# Altium schematic sheet AC Zero-Crossing Detection.SchDoc
size Letter
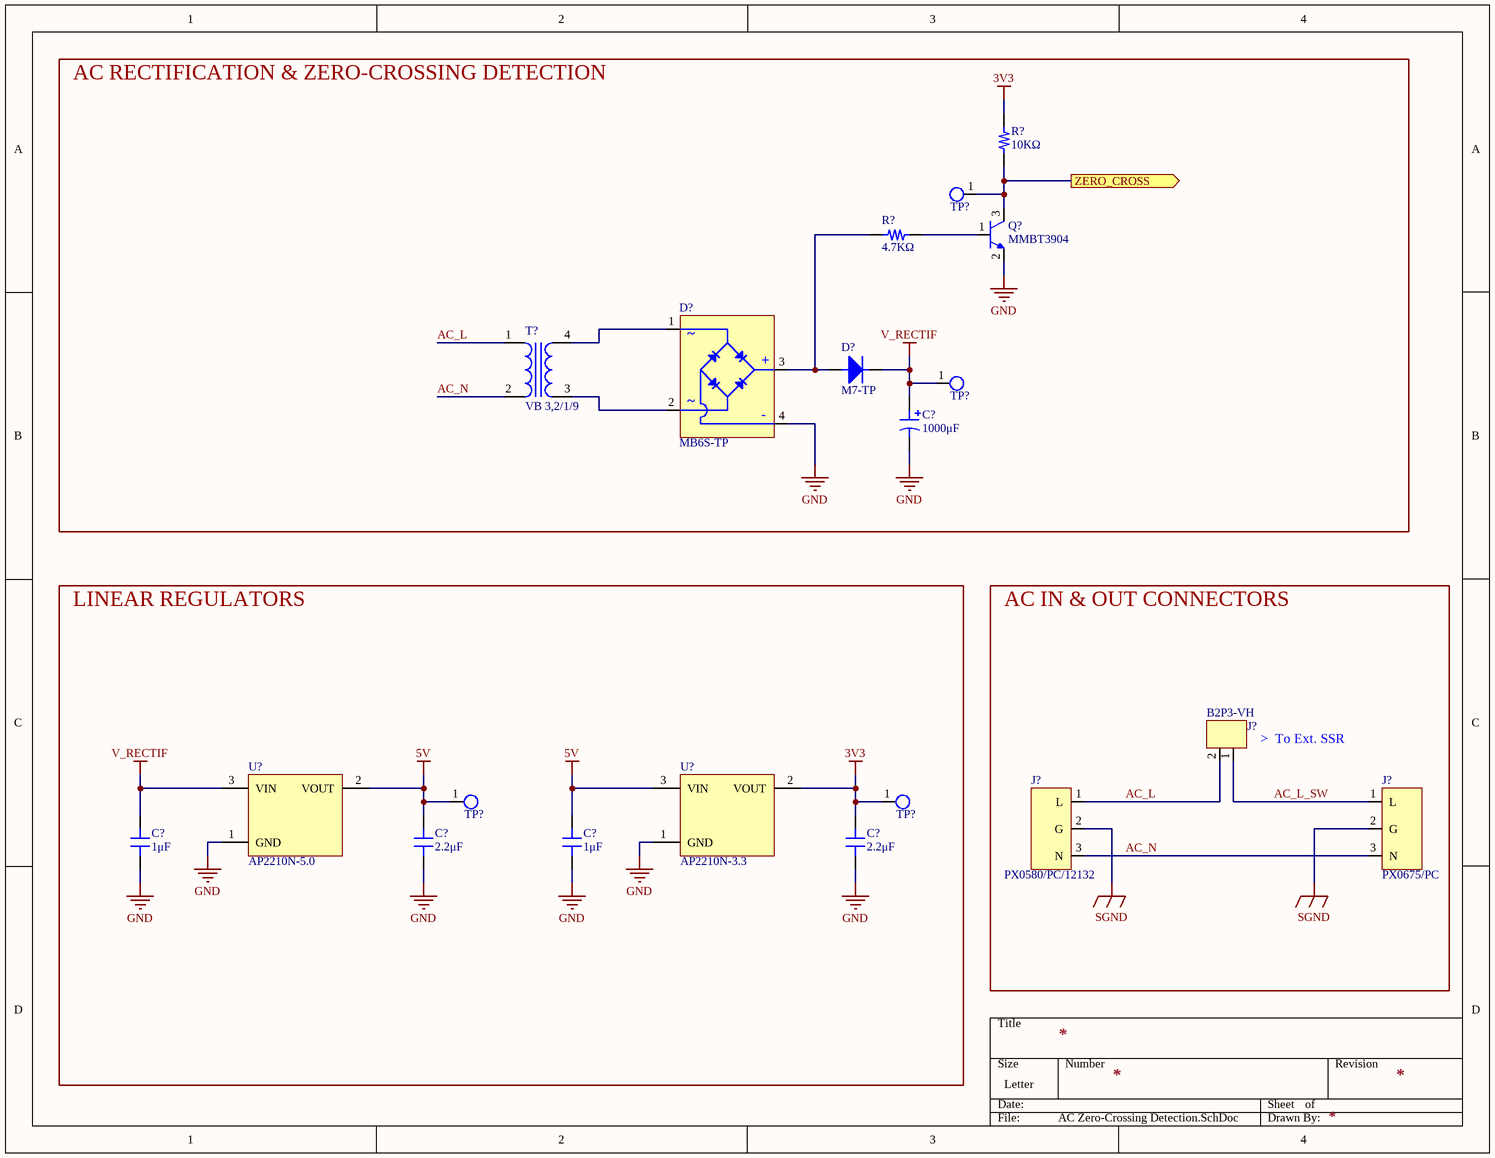
[diagram p0: AC Zero-Crossing Detection.SchDoc]

## Parts
(Parts that share a designator on the sheet are numbered #1, #2 ... from top to bottom, then left to right.)
C?#1  1000μF  [CPOL10X20]
C?#2  1μF  [C0603]
C?#3  2.2μF  [C0805]
C?#4  1μF  [C0603]
C?#5  2.2μF  [C0805]
D?#1  M7-TP  [DO-214AC]
D?#2  MB6S-TP  [MBS-1]
J?#1  B2P3-VH  [B2P3-VH]
J?#2  PX0580/PC/12132  [PX0580/PC/12132]
J?#3  PX0675/PC  [PX0675/PC]
Q?  MMBT3904  [SOT-23]
R?#1  10KΩ  [R0603]
R?#2  4.7KΩ  [R0603]
T?  VB 3,2/1/9  [VB_3,2/1/9]
TP?#1  TP-1MM-ROUND  [TP-1MM-ROUND]  (value not drawn)  (no BOM)
TP?#2  TP-1MM-ROUND  [TP-1MM-ROUND]  (value not drawn)  (no BOM)
TP?#3  TP-1MM-ROUND  [TP-1MM-ROUND]  (value not drawn)  (no BOM)
TP?#4  TP-1MM-ROUND  [TP-1MM-ROUND]  (value not drawn)  (no BOM)
U?#1  AP2210N-5.0  [SOT-23]
U?#2  AP2210N-3.3  [SOP-4]

## Blocks framed on the sheet
AC RECTIFICATION & ZERO-CROSSING DETECTION: C?#1 D?#1 D?#2 Q? R?#1 R?#2 T? TP?#1 TP?#2
LINEAR REGULATORS: C?#2-C?#5 TP?#3 TP?#4 U?#1 U?#2
AC IN & OUT CONNECTORS: J?#1-J?#3

## Ports
ZERO_CROSS (out)

## Nets
3V3: C?#5.2 R?#1.2 TP?#4.1 U?#2.2(VOUT)
5V: C?#3.2 C?#4.2 TP?#3.1 U?#1.2(VOUT) U?#2.3(VIN)
GND: C?#1.2 C?#2.1 C?#3.1 C?#4.1 C?#5.1 D?#2.4 Q?.2(E) U?#1.1(GND) U?#2.1(GND)
SGND: J?#2.2(G) J?#3.2(G)
V_RECTIF: C?#1.1 C?#2.2 D?#1.K TP?#2.1 U?#1.3(VIN)
AC_L: J?#1.2 J?#2.1(L) T?.1
AC_L_SW: J?#1.1 J?#3.1(L)
AC_N: J?#2.3(N) J?#3.3(N) T?.2
ZERO_CROSS: Q?.3(C) R?#1.1 TP?#1.1 ; port ZERO_CROSS
NetD?#1_A: D?#1.A D?#2.3 R?#2.1
NetD?#2_1: D?#2.1(+) T?.4
NetD?#2_2: D?#2.2(-) T?.3
NetQ?_1: Q?.1(B) R?#2.2

## Notes on the sheet
- (near J?#1) >  To Ext. SSR

## Library data of the parts
C?#1 = C-1000UF-16V-CPOL10X20: 1000uF 16V 78mΩ@100kHz ±20% 1.05A@100kHz Plugin,D10xL20mm Aluminum Electrolytic Capacitors - Leaded ROHS; Manufacturer: Rubycon; Manufacturer Part Number: 16YXF1000MEFC10X20; Price Unit: 0.1397; Price 1K: 0.0774; Supplier 1: LCSC; Supplier Part Number 1: C110138
C?#2 C?#4 = C-1UF-16V-X7R-C0603: 16V 1uF X7R ±10% 0603 Multilayer Ceramic Capacitors MLCC - SMD/SMT ROHS; Manufacturer: Samsung Electro-Mechanics; Manufacturer Part Number: CL10B105KO8NNNC; Price Unit: 0.0033; Price 1K: 0.0029; Supplier 1: LCSC; Supplier Part Number 1: C59782
C?#3 C?#5 = C-2.2UF-25V-X7R-C0805: 25V 2.2uF X7R ±10% 0805 Multilayer Ceramic Capacitors MLCC - SMD/SMT ROHS; Manufacturer: Samsung Electro-Mechanics; Manufacturer Part Number: CL21B225KAFNNNE; Price Unit: 0.013; Price 1K: 0.0073; Supplier 1: LCSC; Supplier Part Number 1: C19110
D?#1 = D-1KV-1A-DO-214AC: 1A 1kV 1.1V@1A SMA(DO-214AC) Diodes - General Purpose ROHS; Manufacturer: Micro Commercial Components; Manufacturer Part Number: M7-TP; Price Unit: 0.013; Price 1K: 0.0104; Supplier 1: LCSC; Supplier Part Number 1: C85148
D?#2 = D-BRIDGE-RECTIFIER-600V-0.5A-MBS-1: 35A 1V@400mA 800mA 600V MBS Bridge Rectifiers ROHS; Manufacturer: Micro Commercial Components; Manufacturer Part Number: MB6S-TP; Price Unit: 0.0398; Price 1K: 0.0284; Supplier 1: LCSC; Supplier Part Number 1: C85619
J?#1 = J-2P-7.92MM-B2P3-VH: 1x2P 2P VH 1 7.92mm 2 Brass Plugin,P=7.92mm Wire To Board Connector ROHS; Manufacturer: JST; Manufacturer Part Number: B2P3-VH(LF)(SN); Price Unit: 0.0558; Price 1K: 0.0310; Supplier 1: LCSC; Supplier Part Number 1: C160745
J?#2 = J-3P-IEC-C14-PX0580/PC/12132: C14 Right Angle Panel Mount, PCB Mount IEC Connector Male, 10A, 250 V; Manufacturer: Bulgin; Manufacturer Part Number: PX0580/PC/12132; Price Unit: 5.03; Price 1K: 4.37; Supplier 1: RS; Supplier Part Number 1: 261-5840
J?#3 = J-3P-IEC-C14-PX0675/PC: C13 Right Angle Panel Mount, PCB Mount IEC Connector Socket, 10A, 250 V; Manufacturer: Bulgin; Manufacturer Part Number: PX0675/PC; Price Unit: 6.49; Price 1K: 5.45; Supplier 1: RS; Supplier Part Number 1: 801-948
Q? = Q-NPN-40V-0.2A-SOT-23: 40V 250mW 200mA NPN SOT-23 Bipolar Transistors - BJT ROHS; Manufacturer: Nexperia; Manufacturer Part Number: MMBT3904; Price Unit: 0.0155; Price 1K: 0.0124; Supplier 1: LCSC; Supplier Part Number 1: C108429
R?#1 = R-10K-1/10W-R0603: 100mW Thick Film Resistors 75V ±100ppm/℃ ±1% 10kΩ 0603 Chip Resistor - Surface Mount ROHS; Manufacturer: Yageo; Manufacturer Part Number: RC0603FR-0710KL; Price Unit: 0.0009; Price 1K: 0.0007; Supplier 1: LCSC; Supplier Part Number 1: C98220
R?#2 = R-4.7K-1/10W-R0603: 100mW Thick Film Resistors 75V ±100ppm/℃ ±1% 4.7kΩ 0603 Chip Resistor - Surface Mount ROHS; Manufacturer: Yageo; Manufacturer Part Number: RC0603FR-074K7L; Price Unit: 0.001; Price 1K: 0.0008; Supplier 1: LCSC; Supplier Part Number 1: C99782
T? = T-230V-9V-VB_3,2/1/9: Block 9V ac 1 Output Through Hole PCB Transformer, 3.2VA; Manufacturer: Block; Manufacturer Part Number: VB 3,2/1/9; Price Unit: 7.24; Price 1K: 7.24; Supplier 1: RS; Supplier Part Number 1: 732-0398
TP?#1-TP?#4 = TP-1MM-ROUND: Round Test Point 1mm Dia
U?#1 = U-AP2210N-5.0TRG1-SOT-23: 300mA 75dB@(100Hz) Fixed 5V Positive electrode 13.2V SOT-23 Linear Voltage Regulators (LDO) ROHS; Manufacturer: Diodes Incorporated; Manufacturer Part Number: AP2210N-5.0TRG1; Price Unit: 0.1405; Price 1K: 0.0839; Supplier 1: LCSC; Supplier Part Number 1: C460341
U?#2 = U-AP2210N-3.3TRG1-SOT-23: 300mA 75dB@(100Hz) Fixed 3.3V Positive electrode 13.2V SOT-23 Linear Voltage Regulators (LDO) ROHS; Manufacturer: Diodes Incorporated; Manufacturer Part Number: AP2210N-3.3TRG1; Price Unit: 0.0907; Price 1K: 0.0597; Supplier 1: LCSC; Supplier Part Number 1: C155508